# Altium schematic sheet Clock group.SchDoc (part 1 of 3)
size 594 x 420 mm; Author: ALTIUM GOSTBOM2.0 KEV; SheetNumber: 2; SheetTotal: 48
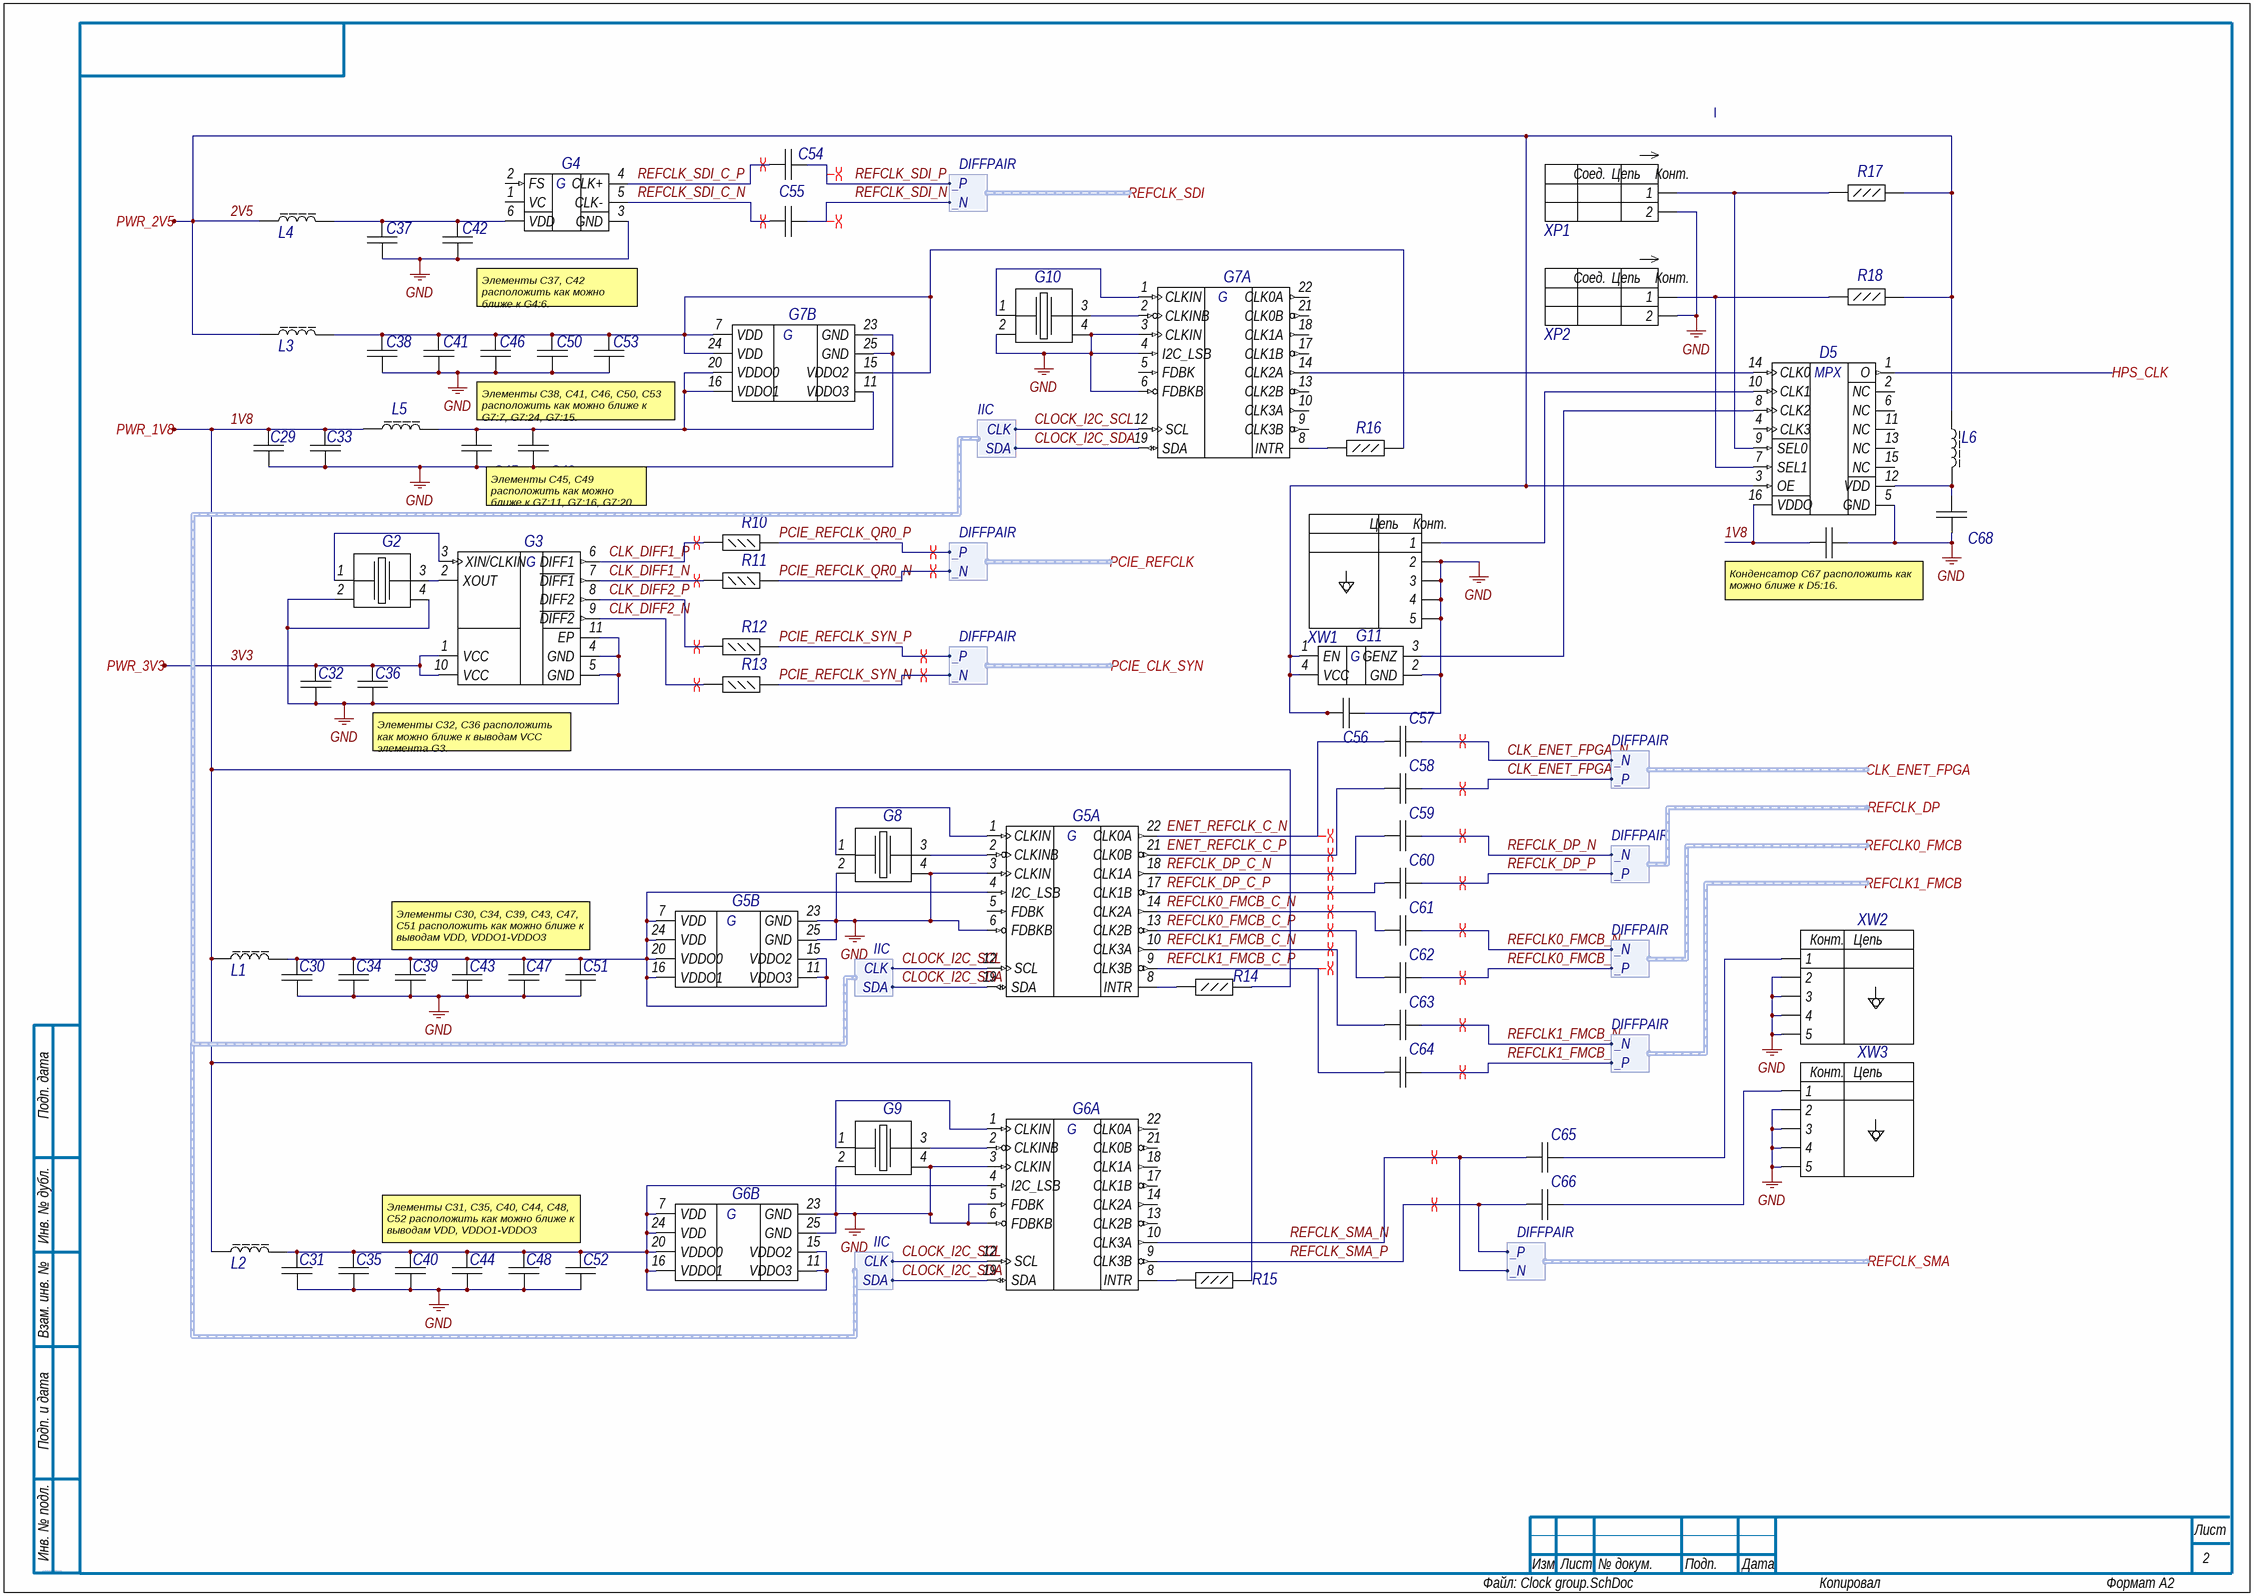
[diagram p0: Clock group.SchDoc]

## Parts
C29  C1005X7R1E104M  [CAPC1005X55X10LL05]  (value not drawn)
C30  C1005X7R1E104M  [CAPC1005X55X10LL05]  (value not drawn)
C31  C1005X7R1E104M  [CAPC1005X55X10LL05]  (value not drawn)
C32  C1005X7R1E104M  [CAPC1005X55X10LL05]  (value not drawn)
C33  C1005X7R1E104M  [CAPC1005X55X10LL05]  (value not drawn)
C34  C1005X7R1E104M  [CAPC1005X55X10LL05]  (value not drawn)
C35  C1005X7R1E104M  [CAPC1005X55X10LL05]  (value not drawn)
C36  GRM188R61A225KE34x  [CAPC1608X90X35ML10T15]  (value not drawn)
C37  C2012X5R1C106K085AC  [CAPC2013X100X20NL20]  (value not drawn)
C38  C1005X7R1E104M  [CAPC1005X55X10LL05]  (value not drawn)
C39  C1005X7R1E104M  [CAPC1005X55X10LL05]  (value not drawn)
C40  C1005X7R1E104M  [CAPC1005X55X10LL05]  (value not drawn)
C41  C1005X7R1E104M  [CAPC1005X55X10LL05]  (value not drawn)
C42  C1005X7R1E104M  [CAPC1005X55X10LL05]  (value not drawn)
C43  C1005X7R1E104M  [CAPC1005X55X10LL05]  (value not drawn)
C44  C1005X7R1E104M  [CAPC1005X55X10LL05]  (value not drawn)
C45  C1005X7R1E104M  [CAPC1005X55X10LL05]  (value not drawn)
C46  C1005X7R1E104M  [CAPC1005X55X10LL05]  (value not drawn)
C47  C1005X7R1E104M  [CAPC1005X55X10LL05]  (value not drawn)
C48  C1005X7R1E104M  [CAPC1005X55X10LL05]  (value not drawn)
C49  C1005X7R1E104M  [CAPC1005X55X10LL05]  (value not drawn)
C50  C1005X7R1E104M  [CAPC1005X55X10LL05]  (value not drawn)
C51  C1005X7R1E104M  [CAPC1005X55X10LL05]  (value not drawn)
C52  C1005X7R1E104M  [CAPC1005X55X10LL05]  (value not drawn)
C53  C1005X7R1E104M  [CAPC1005X55X10LL05]  (value not drawn)
C54  C1005X7R1E104M  [CAPC1005X55X10LL05]  (value not drawn)
C55  C1005X7R1E104M  [CAPC1005X55X10LL05]  (value not drawn)
C56  GRM155R71H103KA88D  [CAPC1005X55X25ML05T10]  (value not drawn)
C57  C1005X7R1E104M  [CAPC1005X55X10LL05]  (value not drawn)
C58  C1005X7R1E104M  [CAPC1005X55X10LL05]  (value not drawn)
C59  C1005X7R1E104M  [CAPC1005X55X10LL05]  (value not drawn)
C60  C1005X7R1E104M  [CAPC1005X55X10LL05]  (value not drawn)
C61  C1005X7R1E104M  [CAPC1005X55X10LL05]  (value not drawn)
C62  C1005X7R1E104M  [CAPC1005X55X10LL05]  (value not drawn)
C63  C1005X7R1E104M  [CAPC1005X55X10LL05]  (value not drawn)
C64  C1005X7R1E104M  [CAPC1005X55X10LL05]  (value not drawn)
C65  C1005X7R1E104M  [CAPC1005X55X10LL05]  (value not drawn)
C66  C1005X7R1E104M  [CAPC1005X55X10LL05]  (value not drawn)
C67  C1005X7R1E104M  [CAPC1005X55X10LL05]  (value not drawn)
C68  C1005X7R1E104M  [CAPC1005X55X10LL05]  (value not drawn)
D5  ICS83054AGILF  [IDT-TSSOP-16_M]  (value not drawn)
G2  FA-128 25.0000MB-C  [EPSON-FA-128_V]  (value not drawn)
G3  Si52112-A1-GM2  [SLAB-TDFN-10_L]  (value not drawn)
G4  516FHA000132AAG  [SLAB-DFN-6-5000X7000DE_A_V]  (value not drawn)
G5  Si5338B-B03799-GM  [SLAB-QFN-24-2550x2550TP_V]  (value not drawn)  (parts A,B of 2)
G6  Si5338B-B03799-GM  [SLAB-QFN-24-2550x2550TP_V]  (value not drawn)  (parts A,B of 2)
G7  Si5338C-B03798-GM  [SLAB-QFN-24-2550x2550TP_V]  (value not drawn)  (parts A,B of 2)
G8  FA-128 25.0000MB-C  [EPSON-FA-128_V]  (value not drawn)
G9  FA-128 25.0000MB-C  [EPSON-FA-128_V]  (value not drawn)
G10  FA-128 25.0000MB-C  [EPSON-FA-128_V]  (value not drawn)
G11  ASE2-33.000MHZ-ET  [ABRA-ASE2_V]  (value not drawn)
L1  BLM15AG221SN1J  [MURA-BLM15-CHIP-2_V]  (value not drawn)
L2  BLM15AG221SN1x  [MURA-BLM15AG221SN1x_V]  (value not drawn)
L3  742792780  [SMD-0402]  (value not drawn)
L4  BLM15AG221SN1x  [MURA-BLM15AG221SN1x_V]  (value not drawn)
L5  742792780  [SMD-0402]  (value not drawn)
L6  742792780  [SMD-0402]  (value not drawn)
R10  ERJ-2GE0R00X  [RESC1005X40X25LL05T05]  (value not drawn)
R11  ERJ-2GE0R00X  [RESC1005X40X25LL05T05]  (value not drawn)
R12  ERJ-2GE0R00X  [RESC1005X40X25LL05T05]  (value not drawn)
R13  ERJ-2GE0R00X  [RESC1005X40X25LL05T05]  (value not drawn)
R14  ERJ-2RKF4701X  [RESC1005X40X25LL05T05]  (value not drawn)
R15  ERJ-2RKF4701X  [RESC1005X40X25LL05T05]  (value not drawn)
R16  ERJ-2RKF1001X  [RESC1005X40X25LL05T05]  (value not drawn)
R17  ERJ-2RKF1001X  [RESC1005X40X25LL05T05]  (value not drawn)
R18  ERJ-2RKF1001X  [RESC1005X40X25LL05T05]  (value not drawn)
XP1  613 002 111 21  [WE-61300211121_V]  (value not drawn)
XP2  613 002 111 21  [WE-61300211121_V]  (value not drawn)
XW1  LTI-SASF54GT  [LHT-LTI-SASF54GT_V]  (value not drawn)
XW2  LTI-SASF54GT  [LHT-LTI-SASF54GT_V]  (value not drawn)
XW3  LTI-SASF54GT  [LHT-LTI-SASF54GT_V]  (value not drawn)

## Ports
CLK_ENET_FPGA (harness DIFFPAIR), HPS_CLK, PCIE_CLK_SYN (harness DIFFPAIR), PCIE_REFCLK (harness DIFFPAIR), PWR_1V8, PWR_2V5, PWR_3V3, REFCLK0_FMCB (harness DIFFPAIR), REFCLK1_FMCB (harness DIFFPAIR), REFCLK_DP (harness DIFFPAIR), REFCLK_SDI (harness DIFFPAIR), REFCLK_SMA (harness DIFFPAIR)

## Harnesses
DIFFPAIR: _P, _N
IIC: CLK, SDA

## Nets
GND: C29.1 C30.2 C31.2 C32.1 C33.1 C34.2 C35.2 C36.1 C37.1 C38.1 C39.2 C40.2 C41.1 C42.1 C43.2 C44.2 C45.1 C46.1 C47.2 C48.2 C49.1 C50.1 C51.2 C52.2 C53.1 C56.1 C67.1 C68.1 D5.5(GND) G2.2(GND) G2.4(GND) G3.4(GND) G3.5(GND) G3.11(EP) G4.3(GND) G5.3(CLKIN) G5.6(FDBKB) G5.23(GND) G5.25(GND) G6.3(CLKIN) G6.5(FDBK) G6.6(FDBKB) G6.23(GND) G6.25(GND) G7.3(CLKIN) G7.4(I2C_LSB) G7.6(FDBKB) G7.23(GND) G7.25(GND) G8.2(GND) G8.4(GND) G9.2(GND) G9.4(GND) G10.2(GND) G10.4(GND) G11.2(GND) XP1.2 XP2.2 XW1.2 XW1.3 XW1.4 XW1.5 XW2.2 XW2.3 XW2.4 XW2.5 XW3.2 XW3.3 XW3.4 XW3.5
1V8: C29.2 C33.2 C67.2 D5.16(VDDO) L1.2 L2.2 L5.2 R14.1 R15.1 ; port PWR_1V8
2V5: C56.2 D5.3(OE) G11.1(EN) G11.4(VCC) L3.2 L4.2 L6.2 R17.1 R18.1 ; port PWR_2V5
3V3: C32.2 C36.2 G3.1(VCC) G3.10(VCC) ; port PWR_3V3
CLK_DIFF1_N: G3.7(~{DIFF1}) R11.1
CLK_DIFF1_P: G3.6(DIFF1) R10.1
CLK_DIFF2_N: G3.9(~{DIFF2}) R13.1
CLK_DIFF2_P: G3.8(DIFF2) R12.1
CLK_ENET_FPGA_N: C57.2 ; port CLK_ENET_FPGA._N
CLK_ENET_FPGA_P: C58.2 ; port CLK_ENET_FPGA._P
CLOCK_I2C_SCL: G5.12(SCL) G6.12(SCL) G7.12(SCL) ; harness IIC.CLK
CLOCK_I2C_SDA: G5.19(SDA) G6.19(SDA) G7.19(SDA) ; harness IIC.SDA
ENET_REFCLK_C_N: C57.1 G5.22(CLK0A)
ENET_REFCLK_C_P: C58.1 G5.21(CLK0B)
HPS_CLK: D5.1(O) ; port HPS_CLK
PCIE_REFCLK_QR0_N: R11.2 ; port PCIE_REFCLK._N
PCIE_REFCLK_QR0_P: R10.2 ; port PCIE_REFCLK._P
PCIE_REFCLK_SYN_N: R13.2 ; port PCIE_CLK_SYN._N
PCIE_REFCLK_SYN_P: R12.2 ; port PCIE_CLK_SYN._P
REFCLK0_FMCB_C_N: C61.1 G5.14(CLK2A)
REFCLK0_FMCB_C_P: C62.1 G5.13(CLK2B)
REFCLK0_FMCB_N: C61.2 ; port REFCLK0_FMCB._N
REFCLK0_FMCB_P: C62.2 ; port REFCLK0_FMCB._P
REFCLK1_FMCB_C_N: C63.1 G5.10(CLK3A)
REFCLK1_FMCB_C_P: C64.1 G5.9(CLK3B)
REFCLK1_FMCB_N: C63.2 ; port REFCLK1_FMCB._N
REFCLK1_FMCB_P: C64.2 ; port REFCLK1_FMCB._P
REFCLK_DP_C_N: C59.1 G5.18(CLK1A)
REFCLK_DP_C_P: C60.1 G5.17(CLK1B)
REFCLK_DP_N: C59.2 ; port REFCLK_DP._N
REFCLK_DP_P: C60.2 ; port REFCLK_DP._P
REFCLK_SDI_C_N: C55.2 G4.5(CLK-)
REFCLK_SDI_C_P: C54.2 G4.4(CLK+)
REFCLK_SDI_N: C55.1 ; port REFCLK_SDI._N
REFCLK_SDI_P: C54.1 ; port REFCLK_SDI._P
REFCLK_SMA_N: C65.1 G6.10(CLK3A) ; port REFCLK_SMA._N
REFCLK_SMA_P: C66.1 G6.9(CLK3B) ; port REFCLK_SMA._P
NetC30_1: C30.1 C34.1 C39.1 C43.1 C47.1 C51.1 G5.4(I2C_LSB) G5.7(VDD) G5.11(VDDO3) G5.15(VDDO2) G5.16(VDDO1) G5.20(VDDO0) G5.24(VDD) L1.1
NetC31_1: C31.1 C35.1 C40.1 C44.1 C48.1 C52.1 G6.4(I2C_LSB) G6.7(VDD) G6.11(VDDO3) G6.15(VDDO2) G6.16(VDDO1) G6.20(VDDO0) G6.24(VDD) L2.1
NetC37_2: C37.2 C42.2 G4.6(VDD) L4.1
NetC38_2: C38.2 C41.2 C46.2 C50.2 C53.2 G7.7(VDD) G7.15(VDDO2) G7.24(VDD) L3.1 R16.1
NetC45_2: C45.2 C49.2 G7.11(VDDO3) G7.16(VDDO1) G7.20(VDDO0) L5.1
NetC65_2: C65.2 XW2.1
NetC66_2: C66.2 XW3.1
NetC68_2: C68.2 D5.12(VDD) L6.1
NetD5_7: D5.7(SEL1) R18.2 XP2.1
NetD5_8: D5.8(CLK2) G11.3(GENZ)
NetD5_9: D5.9(SEL0) R17.2 XP1.1
NetD5_10: D5.10(CLK1) XW1.1
NetD5_14: D5.14(CLK0) G7.14(CLK2A)
NetG2_1: G2.1(X1) G3.3(XIN/CLKIN)
NetG2_3: G2.3(X2) G3.2(XOUT)
NetG5_1: G5.1(CLKIN) G8.1(X1)
NetG5_2: G5.2(CLKINB) G8.3(X2)
NetG5_8: G5.8(INTR) R14.2
NetG6_1: G6.1(CLKIN) G9.1(X1)
NetG6_2: G6.2(CLKINB) G9.3(X2)
NetG6_8: G6.8(INTR) R15.2
NetG7_1: G7.1(CLKIN) G10.1(X1)
NetG7_2: G7.2(CLKINB) G10.3(X2)
NetG7_8: G7.8(INTR) R16.2

Not connected (* = marked no-connect by the designer): D5 2(NC) 4(CLK3) 6(NC) 11(NC) 13(NC) 15(NC); G4 1(VC) 2(FS); G5 5(FDBK); G6 13(CLK2B) 14(CLK2A) 17(CLK1B) 18(CLK1A) 21(CLK0B) 22(CLK0A); G7 5(FDBK) 9(CLK3B) 10(CLK3A) 13(CLK2B) 17(CLK1B) 18(CLK1A) 21(CLK0B) 22(CLK0A)

## Layout directives
differential pair: CLK_DIFF1_N, CLK_DIFF1_P, CLK_DIFF2_N, CLK_DIFF2_P, CLK_ENET_FPGA_N, CLK_ENET_FPGA_P, ENET_REFCLK_C_N, ENET_REFCLK_C_P, PCIE_REFCLK_QR0_N, PCIE_REFCLK_QR0_P, PCIE_REFCLK_SYN_N, PCIE_REFCLK_SYN_P, REFCLK0_FMCB_C_N, REFCLK0_FMCB_C_P, REFCLK0_FMCB_N, REFCLK0_FMCB_P, REFCLK1_FMCB_C_N, REFCLK1_FMCB_C_P, REFCLK1_FMCB_N, REFCLK1_FMCB_P, REFCLK_DP_C_N, REFCLK_DP_C_P, REFCLK_DP_N, REFCLK_DP_P, REFCLK_SDI_C_N, REFCLK_SDI_C_P, REFCLK_SDI_N, REFCLK_SDI_P, REFCLK_SMA_N, REFCLK_SMA_P

## Notes on the sheet
- Элементы C37, C42 расположить как можно ближе к G4:6.
- Элементы C38, C41, C46, C50, C53 расположить как можно ближе к G7:7, G7:24, G7:15.
- Элементы C45, C49 расположить как можно ближе к G7:11, G7:16, G7:20.
- (near C67) Конденсатор C67 расположить как можно ближе к D5:16.
- Элементы C32, C36 расположить как можно ближе к выводам VCC элемента G3.
- Элементы C30, C34, C39, C43, C47, C51 расположить как можно ближе к выводам VDD, VDDO1-VDDO3 элемента G5.
- Элементы C31, C35, C40, C44, C48, C52 расположить как можно ближе к выводам VDD, VDDO1-VDDO3 элемента G6.
- Подп. дата
- Инв. № дубл.
- Взам. инв. №
- Подп. и дата
- Инв. № подл.
- Изм.
- Лист
- № докум.
- Подп.
- Дата
- ALTIUM GOSTBOM2.0 KEV
- Файл:
- Копировал
- Формат А2
- (in symbol E32) Соед.; Цепь; Конт.
- (in symbol E42) Цепь; Конт.
- (in symbol E122, part A) G
- (in symbol E122, part B) G
- (in symbol E123) G
- (in symbol E124, part A) G
- (in symbol E124, part B) G
- (in symbol E125) MPX
- (in symbol E126) G
- (in symbol E128) G